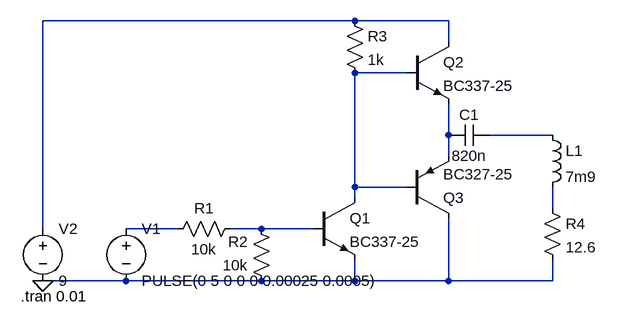
[diagram p0: schematic TXAmp.asc]
TXAmp.asc, the LTspice schematic file:
Version 4
SHEET 1 880 680
WIRE 400 -128 -80 -128
WIRE 544 -128 400 -128
WIRE 544 -96 544 -128
WIRE 480 -48 400 -48
WIRE 544 48 544 0
WIRE 704 48 608 48
WIRE 544 80 544 48
WIRE 400 128 400 -48
WIRE 480 128 400 128
WIRE 400 144 400 128
WIRE 704 160 704 128
WIRE -80 192 -80 -128
WIRE 128 192 48 192
WIRE 256 192 208 192
WIRE 336 192 256 192
WIRE 48 272 -80 272
WIRE 256 272 48 272
WIRE 400 272 400 240
WIRE 400 272 256 272
WIRE 544 272 544 176
WIRE 544 272 400 272
WIRE 704 272 704 240
WIRE 704 272 544 272
FLAG -80 272 0
SYMBOL voltage 48 176 R0
WINDOW 123 0 0 Left 0
WINDOW 39 0 0 Left 0
SYMATTR InstName V1
SYMATTR Value PULSE(0 5 0 0 0 0.00025 0.0005)
SYMBOL voltage -80 176 R0
WINDOW 123 0 0 Left 0
WINDOW 39 0 0 Left 0
SYMATTR InstName V2
SYMATTR Value 9
SYMBOL res 224 176 R90
WINDOW 0 0 56 VBottom 2
WINDOW 3 32 56 VTop 2
SYMATTR InstName R1
SYMATTR Value 10k
SYMBOL res 272 288 R180
WINDOW 0 36 76 Left 2
WINDOW 3 36 40 Left 2
SYMATTR InstName R2
SYMATTR Value 10k
SYMBOL npn 336 144 R0
SYMATTR InstName Q1
SYMATTR Value BC337-25
SYMBOL npn 480 -96 R0
SYMATTR InstName Q2
SYMATTR Value BC337-25
SYMBOL res 384 -144 R0
SYMATTR InstName R3
SYMATTR Value 1k
SYMBOL cap 608 32 R90
WINDOW 0 0 32 VBottom 2
WINDOW 3 32 32 VTop 2
SYMATTR InstName C1
SYMATTR Value 820n
SYMBOL ind 688 32 R0
SYMATTR InstName L1
SYMATTR Value 7m9
SYMBOL res 688 144 R0
SYMATTR InstName R4
SYMATTR Value 12.6
SYMBOL pnp 480 176 M180
SYMATTR InstName Q3
SYMATTR Value BC327-25
TEXT -114 296 Left 2 !.tran 0.01

The netlist it stands for:
* TXAmp.asc
V1 N006 0 PULSE(0 5 0 0 0 0.00025 0.0005)
V2 N001 0 9
R1 N007 N006 10k
R2 0 N007 10k
Q1 N002 N007 0 0 BC337-25
Q2 N001 N002 N003 0 BC337-25
R3 N001 N002 1k
C1 N004 N003 820n
L1 N004 N005 7m9
R4 N005 0 12.6
Q3 0 N002 N003 0 BC327-25
.model NPN NPN
.model PNP PNP
.lib standard.bjt
.tran 0.01
.backanno
.end